# EAGLE design Bee Snuggler - Devel (EAGLE 9.6.2)
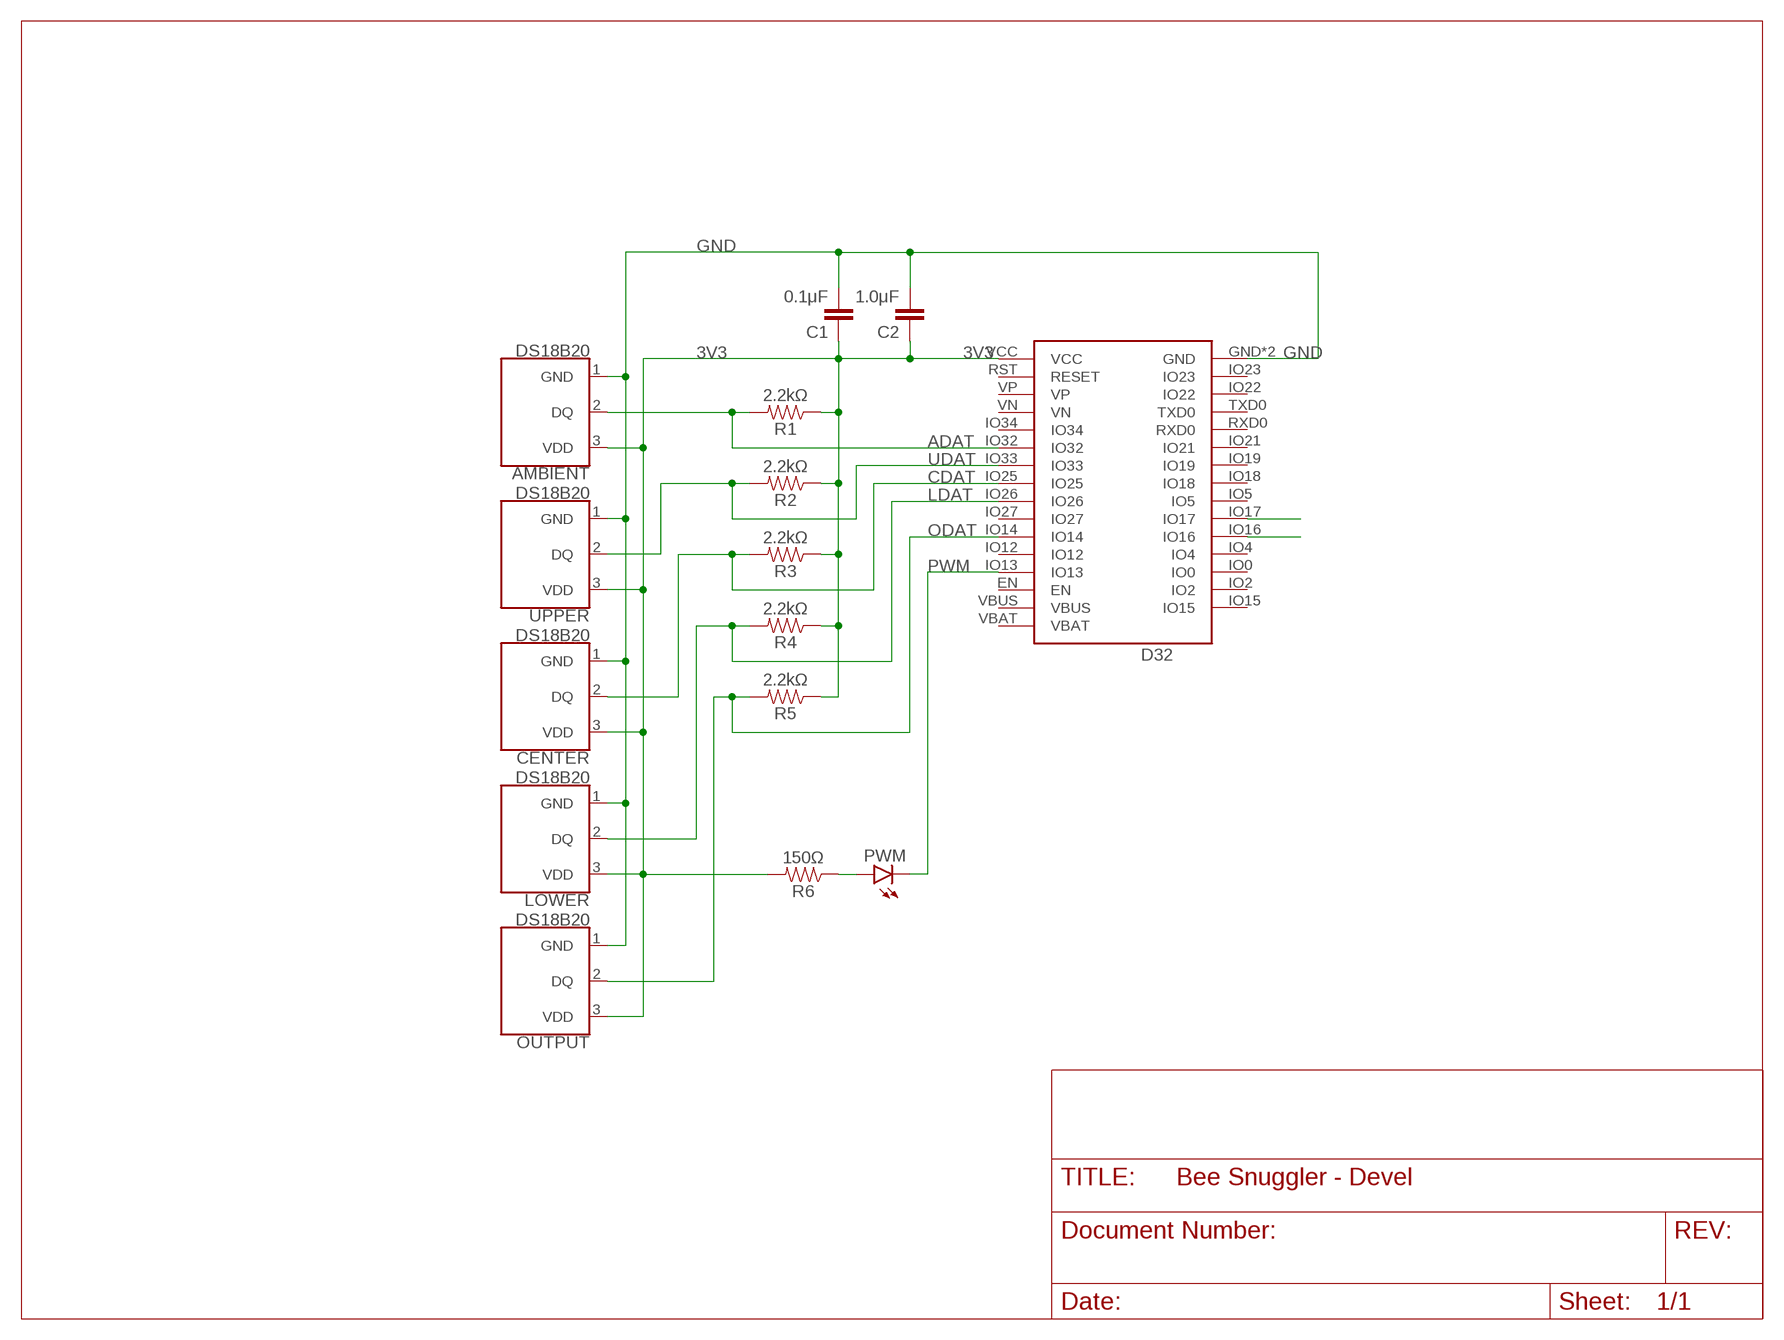
[diagram p0: schematic, sheet 1]

## Parts
AMBIENT  DS18B20  [TO-92-AMMO]
C1  0.1μF  CAP_CERAMIC_2.54  [CAP_PTH-2.54]
C2  1.0μF  CAP_CERAMIC_2.54  [CAP_PTH-2.54]
CENTER  DS18B20  [TO-92-AMMO]
D32  Lolin D32  WEMOS-D32D32_PRO  [D32_PRO]
LOWER  DS18B20  [TO-92-AMMO]
OUTPUT  DS18B20  [TO-92-AMMO]
PWM  LED5MM  [LED5MM]
R1  2.2kΩ  RESISTORAXIAL-0.3  [AXIAL-0.3]
R2  2.2kΩ  RESISTORAXIAL-0.3  [AXIAL-0.3]
R3  2.2kΩ  RESISTORAXIAL-0.3  [AXIAL-0.3]
R4  2.2kΩ  RESISTORAXIAL-0.3  [AXIAL-0.3]
R5  2.2kΩ  RESISTORAXIAL-0.3  [AXIAL-0.3]
R6  150Ω  RESISTORAXIAL-0.3  [AXIAL-0.3]
UPPER  DS18B20  [TO-92-AMMO]

## Nets
3V3 [3v]: AMBIENT.3(VDD) C1.1 C2.1 CENTER.3(VDD) D32.VCC LOWER.3(VDD) OUTPUT.3(VDD) R1.P$1 R2.P$1 R3.P$1 R4.P$1 R5.P$1 R6.P$2 UPPER.3(VDD)
ADAT: AMBIENT.2(DQ) D32.IO32 R1.P$2
CDAT: CENTER.2(DQ) D32.IO25 R3.P$2
GND: AMBIENT.1(GND) C1.2 C2.2 CENTER.1(GND) D32.GND D32.GND2(GND) LOWER.1(GND) OUTPUT.1(GND) UPPER.1(GND)
LDAT: D32.IO26 LOWER.2(DQ) R4.P$2
N$1: PWM.A R6.P$1
N$4: D32.IO16
N$5: D32.IO17
ODAT: D32.IO14 OUTPUT.2(DQ) R5.P$2
PWM: D32.IO13 PWM.K(C)
UDAT: D32.IO33 R2.P$2 UPPER.2(DQ)
Unconnected: D32.EN D32.IO0 D32.IO2 D32.IO4 D32.IO5 D32.IO12 D32.IO15 D32.IO18 D32.IO19 D32.IO21 D32.IO22 D32.IO23 D32.IO27 D32.IO34 D32.RST(RESET) D32.RXD0 D32.TXD0 D32.VBAT D32.VBUS D32.VN D32.VP

## Library data of the parts
AMBIENT CENTER LOWER OUTPUT UPPER = SparkFun-Sensors:DS18B20: Dallas/Maxim DS18B20 1-Wire Temperature Sensor The DS18B20 reports degrees C with 9 to 12-bit precision, -55C to 125C (+/-0.5C). Each sensor has a unique 64-Bit Serial number etched into it - allows for a huge number of sensors to be used on one data bus. Datasheet <http://datasheets.maximintegrated.com/en/ds/DS18B20.pdf> SparkFun Products One Wire Digital Temperature Sensor - DS18B20 <https://www.sparkfun.com/products/245> (SEN-00245); STORE_ID: SEN-00245
C1 C2 = Donnie:CAP_CERAMIC_2.54
D32 = Donnie:WEMOS-D32: D32_REVERSE is a Reverse silkscreen for placing the Wemos D32 on the underside of the board D32_NO-KEEPOUT removes the keepout area beneath the antenna on the D32 and provides a note to avoid components and traces.
PWM = led:LED: LED OSRAM: - CHIPLED LG R971, LG N971, LY N971, LG Q971, LY Q971, LO R971, LY R971 LH N974, LH R974 LS Q976, LO Q976, LY Q976 LO Q996 - Hyper CHIPLED LW Q18S LB Q993, LB Q99A, LB R99A - SideLED LS A670, LO A670, LY A670, LG A670, LP A670 LB A673, LV A673, LT A673, LW A673 LH A674 LY A675 LS A676, LA A676, LO A676, LY A676, LW A676 LS A679, LY A679, LG A679 - Hyper Micro SIDELED® LS Y876, LA Y876, LO Y876, LY Y876 LT Y87S - SmartLED LW L88C, LW L88S LB L89C, LB L89S, LG L890 LS L89K, LO L89K, LY L89K LS L896, LA L896, LO L896, LY L896 - TOPLED LS T670, LO T670, LY T670, LG T670, LP T670 LSG T670, LSP T670, LSY T670, LOP T670, LYG T670 LG T671, LOG T671, LSG T671 LB T673, LV T673, LT T673, LW T673 LH T674 LS T676, LA T676, LO T676, LY T676, LB T676, LH T676, LSB T676, LW T676 LB T67C, LV T67C, LT T67C, LS T67K, LO T67K, LY T67K, LW E67C LS E67B, LA E67B, LO E67B, LY E67B, LB E67C, LV E67C, LT E67C LW T67C LS T679, LY T679, LG T679 LS T770, LO T770, LY T770, LG T770, LP T770 LB T773, LV T773, LT T773, LW T773 LH T774 LS E675, LA E675, LY E675, LS T675 LS T776, LA T776, LO T776, LY T776, LB T776 LHGB T686 LT T68C, LB T68C - Hyper Mini TOPLED® LB M676 - Mini TOPLED Santana® LG M470 LS M47K, LO M47K, LY M47K Source: http://www.osram.convergy.de LUXEON: - LUMILED® LXK2-PW12-R00, LXK2-PW12-S00, LXK2-PW14-U00, LXK2-PW14-V00 LXK2-PM12-R00, LXK2-PM12-S00, LXK2-PM14-U00 LXK2-PE12-Q00, LXK2-PE12-R00, LXK2-PE12-S00, LXK2-PE14-T00, LXK2-PE14-U00 LXK2-PB12-K00, LXK2-PB12-L00, LXK2-PB12-M00, LXK2-PB14-N00, LXK2-PB14-P00, LXK2-PB14-Q00 LXK2-PR12-L00, LXK2-PR12-M00, LXK2-PR14-Q00, LXK2-PR14-R00 LXK2-PD12-Q00, LXK2-PD12-R00, LXK2-PD12-S00 LXK2-PH12-R00, LXK2-PH12-S00 LXK2-PL12-P00, LXK2-PL12-Q00, LXK2-PL12-R00 Source: www.luxeon.com KINGBRIGHT: KA-3528ASYC Source: www.kingbright.com
R1-R6 = SparkFun-Resistors:RESISTOR: Generic Resistor Package

## Net classes
0 default: width 0.305 mm, clearance 0.305 mm
1 5v: width 0.406 mm, clearance 0.406 mm
2 3v: width 0.406 mm, clearance 0.406 mm

## Board
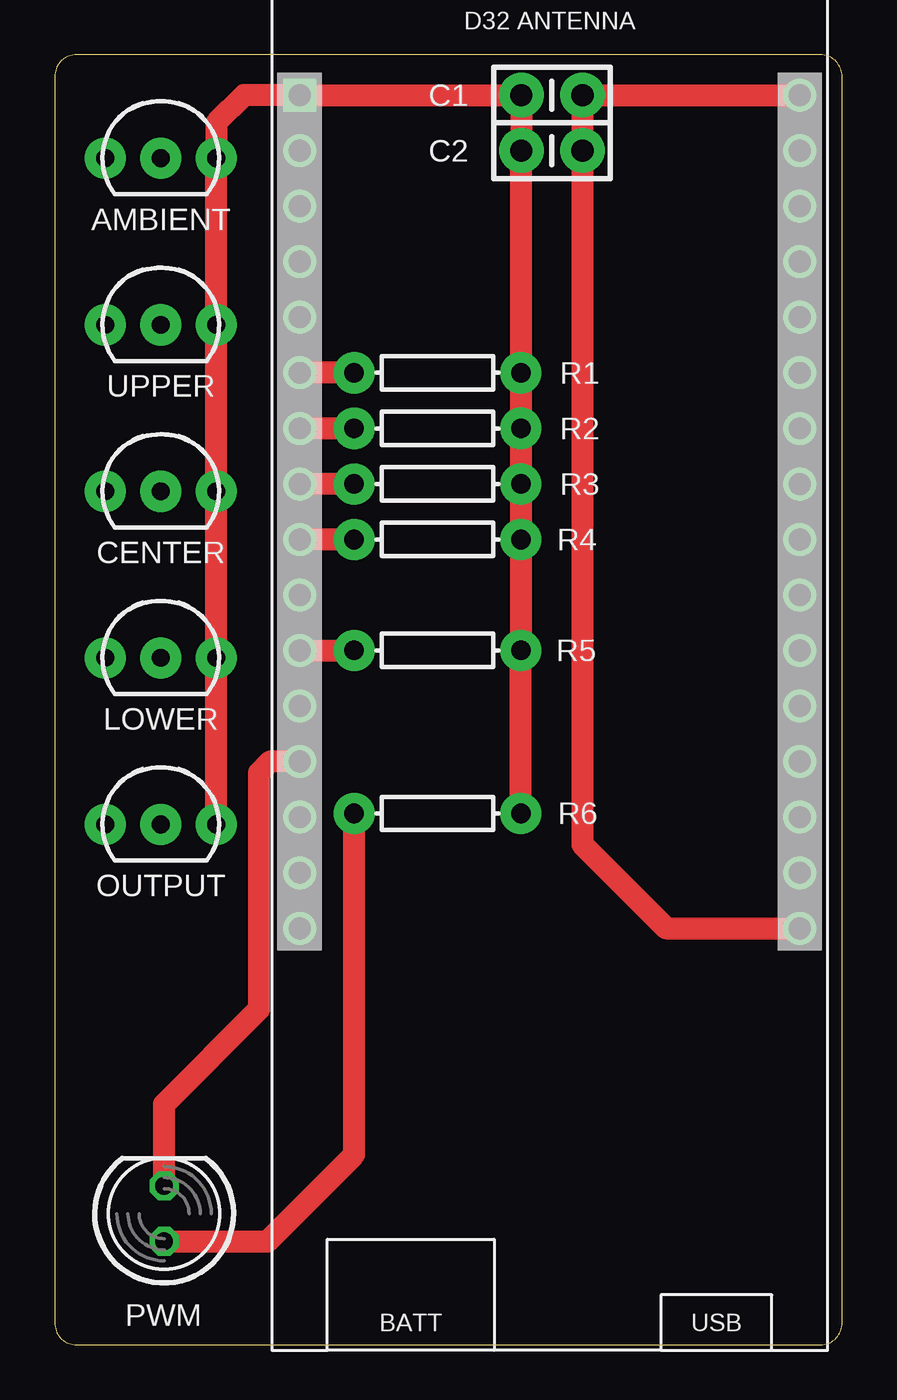
[diagram p1: board, top side]
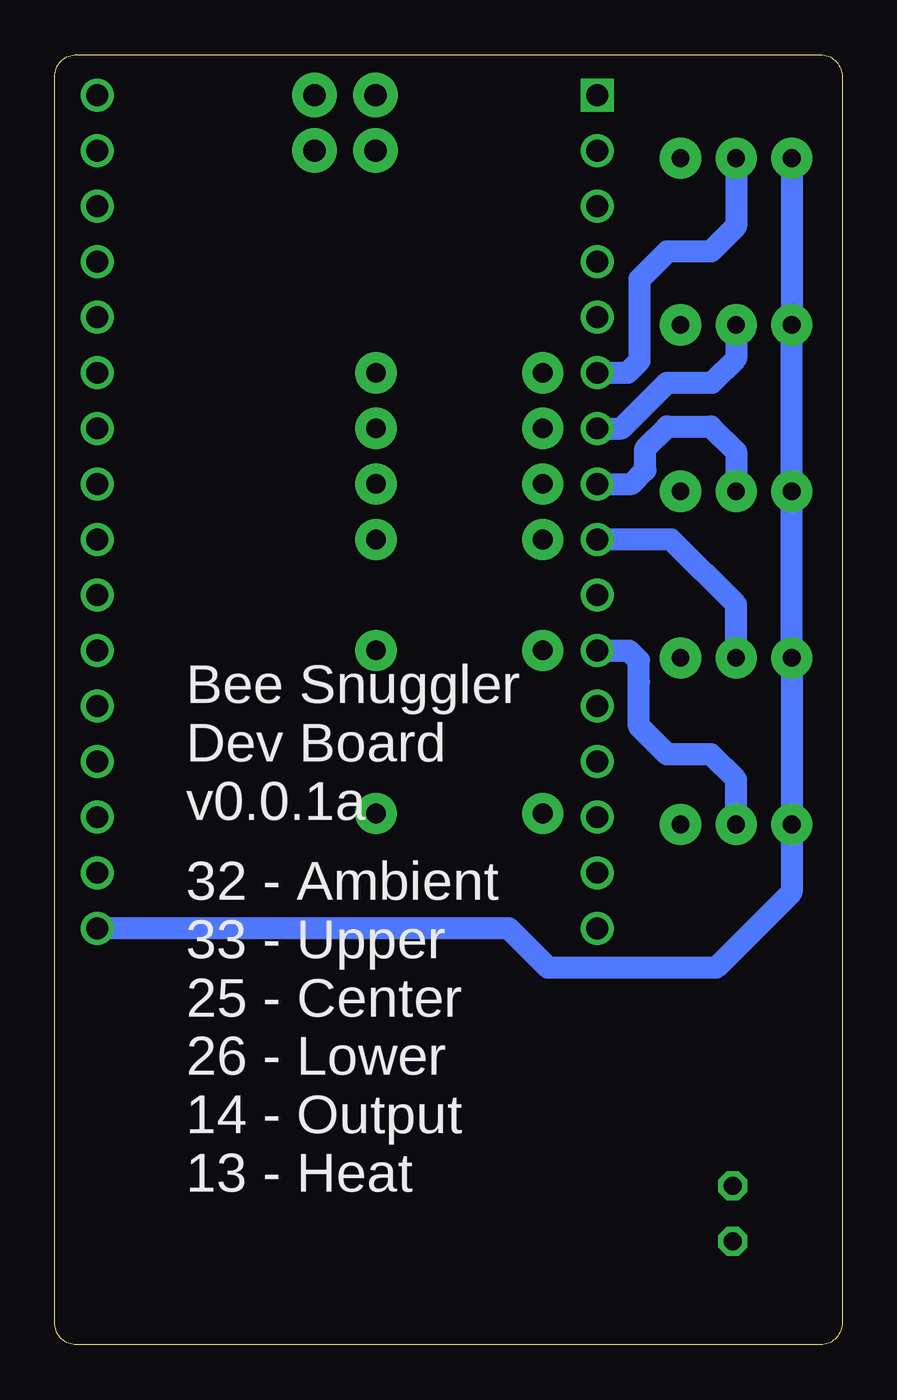
[diagram p2: board, bottom side, seen from below]

Size 36 x 59 mm. Coordinates in mm from the lower left corner, seen from the top.
Outline: 0,58 0,1 arc90 1,0 35,0 arc90 36,1 36,58 arc90 35,59 1,59 arc90 0,58
Copper layers (1*16): Top 0.035mm / dielectric 1.5mm / Bottom 0.035mm
Design rules "default": minimum track width 6mil, minimum drill 0.35mm, track to track 6mil, track to pad 6mil, pad to pad 6mil, via to via 6mil, smd to smd 6mil, copper to edge 40mil, drill to drill 6mil, minimum pad ring 10mil, minimum via ring 8mil, stop-mask expansion 4mil, vias tented up to drill 0mil, thermal gap 10mil

### Footprints (pad centres in the part's own frame; a part is rotated, then mirrored left to right if it is on the bottom)
TO-92-AMMO = drill 0.813 pad 1.88: 1 -2.54,0; 2 0,0; 3 2.54,0
CAP_PTH-2.54 = drill 1.016 pad 2.032: 1 -1.397,0; 2 1.397,0
D32_PRO = drill 1: EN -11.43,-12.7; GND 11.43,20.32; GND2 11.43,-17.78; IO0 11.43,-10.16; IO2 11.43,-12.7; IO4 11.43,-7.62; IO5 11.43,0; IO12 -11.43,-7.62; IO13 -11.43,-10.16; IO14 -11.43,-5.08; IO15 11.43,-15.24; IO16 11.43,-5.08; IO17 11.43,-2.54; IO18 11.43,2.54; IO19 11.43,5.08; IO21 11.43,7.62; IO22 11.43,15.24; IO23 11.43,17.78; IO25 -11.43,2.54; IO26 -11.43,0; IO27 -11.43,-2.54; IO32 -11.43,7.62; IO33 -11.43,5.08; IO34 -11.43,10.16; RST -11.43,17.78; RXD0 11.43,10.16; TXD0 11.43,12.7; VBAT -11.43,-17.78; VBUS -11.43,-15.24; VN -11.43,12.7; VP -11.43,15.24 | drill 1 square: VCC -11.43,20.32
LED5MM = drill 0.813 octagon: A -1.27,0; K 1.27,0
AXIAL-0.3 = drill 0.9 pad 1.88: P$1 -3.81,0; P$2 3.81,0

### Placement (x,y rotation side)
AMBIENT  4.85,54.26 0 top
C1  22.73,57.15 0 top
C2  22.73,54.61 0 top
CENTER  4.85,39.03 0 top
D32  22.63,36.83 0 top
LOWER  4.85,31.41 0 top
OUTPUT  4.85,23.8 0 top
PWM  5,6 90 top
R1  17.5,44.45 180 top
R2  17.5,41.91 180 top
R3  17.5,39.37 180 top
R4  17.5,36.83 180 top
R5  17.5,31.76 180 top
R6  17.5,24.3 0 top
UPPER  4.85,46.65 0 top

### Tracks (layer width: path | path; a pad name or v marks a point on that pad's centre or on a via)
3V3
  Top 1.016: R6.P$2 R5.P$1 R4.P$1 R3.P$1 R2.P$1 R1.P$1 21.31,54.59 C2.1 C1.1 D32.VCC 8.66,57.15 7.39,55.88 AMBIENT.3 UPPER.3 CENTER.3 LOWER.3 OUTPUT.3
ADAT
  Top 1.016: R1.P$2 D32.IO32
  Bottom 1.016: D32.IO32 9.81,44.45 9.26,45 9.26,48.74 8,50 6,50 4.85,51.15 AMBIENT.2
CDAT
  Top 1.016: R3.P$2 D32.IO25
  Bottom 1.016: CENTER.2 4.85,40.85 6,42 8,42 9,41 9,40 9.63,39.37 D32.IO25
GND
  Top 1.016: D32.GND C1.2 C2.2 24.13,22.87 27.95,19.05 D32.GND2
  Bottom 1.016: AMBIENT.1 UPPER.1 CENTER.1 LOWER.1 OUTPUT.1 2.31,20.69 5.76,17.24 6.58,17.24 13.44,17.24 15.25,19.05 D32.GND2
LDAT
  Top 1.016: R4.P$2 D32.IO26
  Bottom 1.016: LOWER.2 4.85,33.85 7.83,36.83 D32.IO26
N$1
  Top 1.016: PWM.A 9.73,4.73 13.69,8.69 R6.P$1
ODAT
  Top 1.016: D32.IO14 R5.P$2
  Bottom 1.016: D32.IO14 9.75,31.75 9.3,31.3 9.3,30.3 9.3,28.3 8,27 6,27 4.85,25.85 OUTPUT.2
PWM
  Top 1.016: PWM.K 5,11 9.33,15.33 9.33,26.16 9.84,26.67 D32.IO13
UDAT
  Top 1.016: R2.P$2 D32.IO33
  Bottom 1.016: D32.IO33 10.09,41.91 8,44 5.96,44 4.85,45.11 UPPER.2

### Text on the board
bNames: Bee Snuggler / Dev Board / v0.0.1a | 32 - Ambient / 33 - Upper / 25 - Center / 26 - Lower / 14 - Output / 13 - Heat